# EAGLE design vw_j533 (EAGLE 9.6.2)
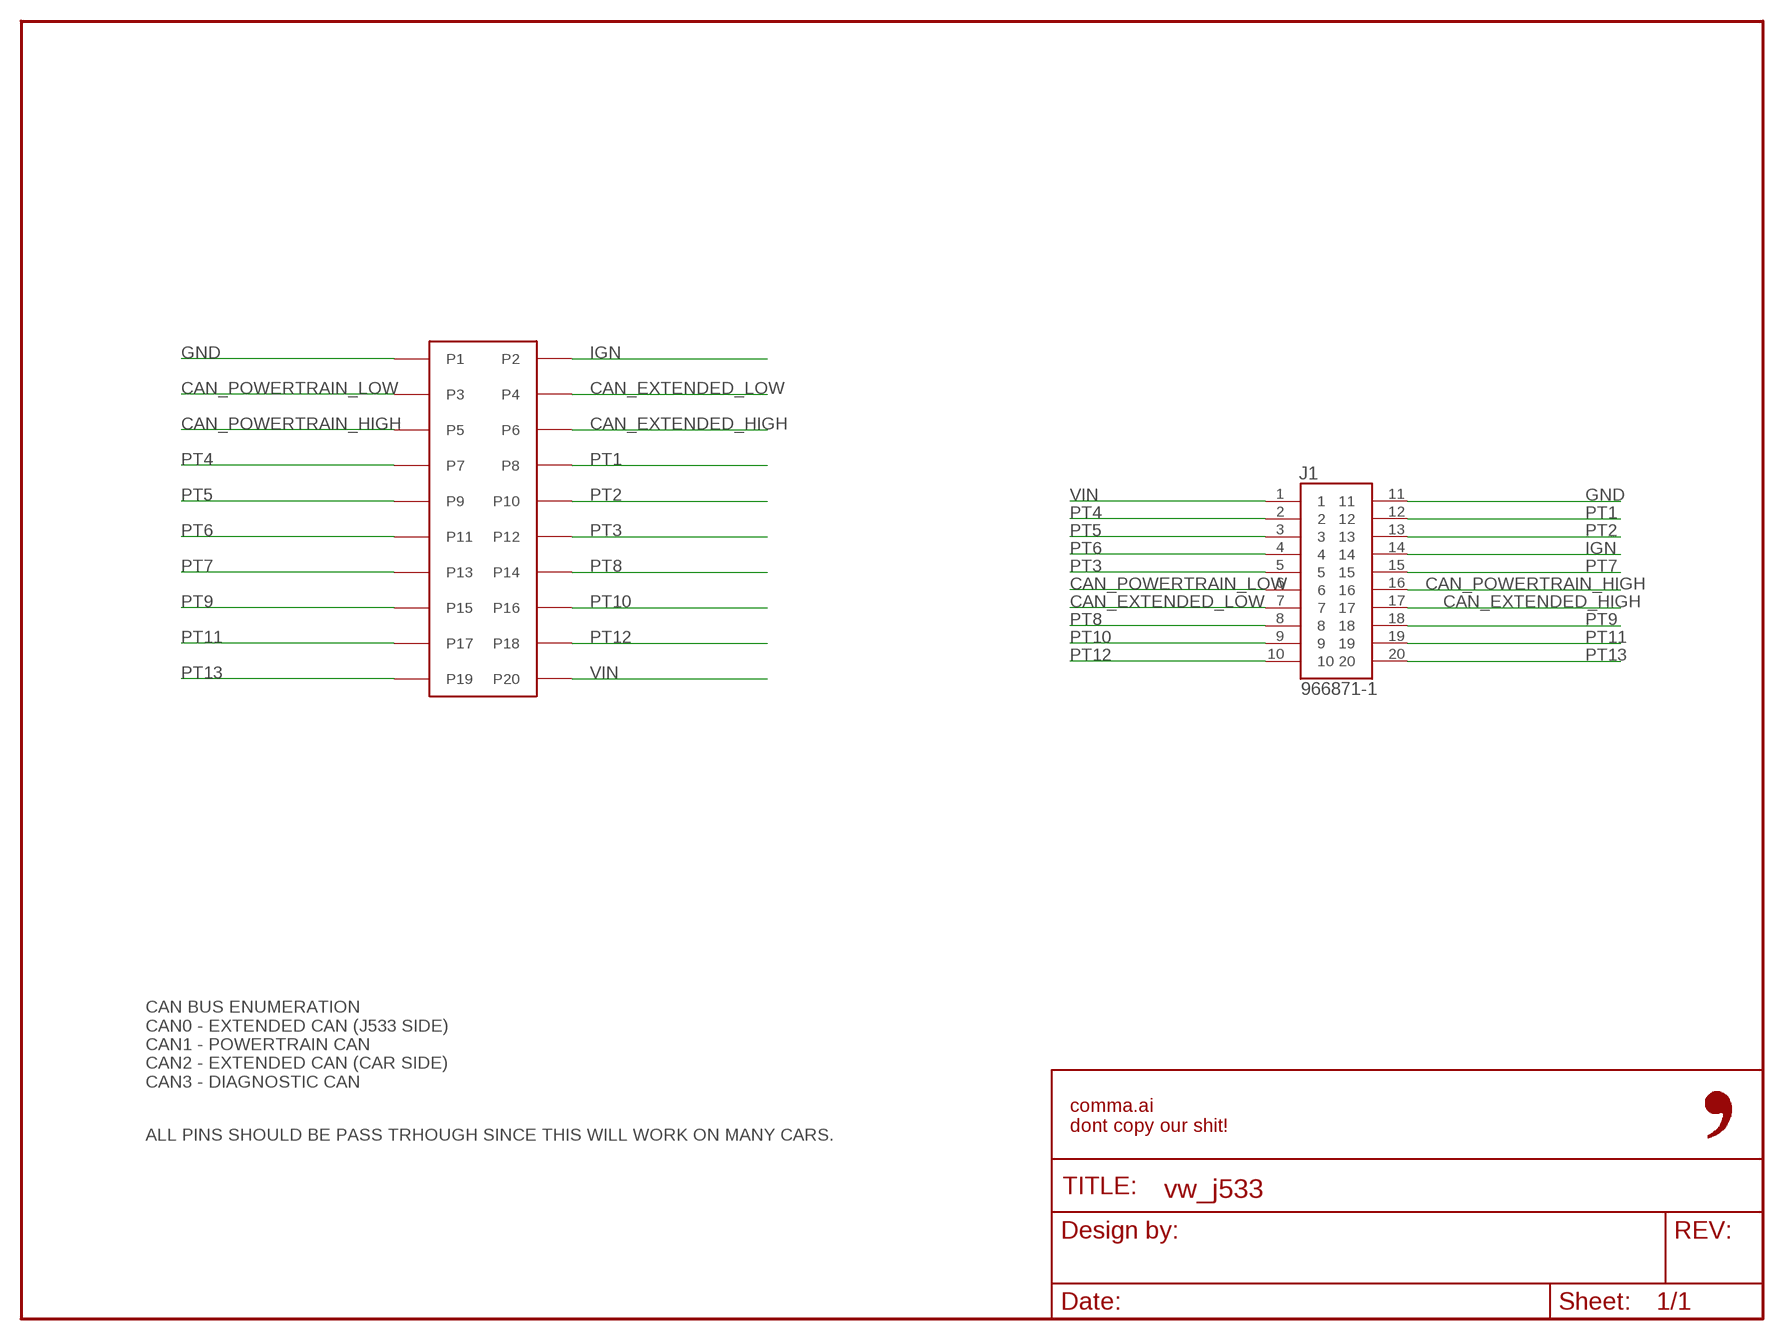
[diagram p0: schematic, sheet 1]

## Parts
FRAME1  FRAME-LETTERNO_PACKAGE  [DUMMY]
J1  966871-1  [TE_966871-1]
J2  5018762040  [5018762040]

## Nets
CAN_EXTENDED_HIGH: J1.17 J2.P6
CAN_EXTENDED_LOW: J1.7 J2.P4
CAN_POWERTRAIN_HIGH: J1.16 J2.P5
CAN_POWERTRAIN_LOW: J1.6 J2.P3
GND: J1.11 J2.P1
IGN: J1.14 J2.P2
PT1: J1.12 J2.P8
PT2: J1.13 J2.P10
PT3: J1.5 J2.P12
PT4: J1.2 J2.P7
PT5: J1.3 J2.P9
PT6: J1.4 J2.P11
PT7: J1.15 J2.P13
PT8: J1.8 J2.P14
PT9: J1.18 J2.P15
PT10: J1.9 J2.P16
PT11: J1.19 J2.P17
PT12: J1.10 J2.P18
PT13: J1.20 J2.P19
VIN: J1.1 J2.P20

## Notes on the sheet
- CAN BUS ENUMERATION
  CAN0 - EXTENDED CAN (J533 SIDE)
  CAN1 - POWERTRAIN CAN
  CAN2 - EXTENDED CAN (CAR SIDE)
  CAN3 - DIAGNOSTIC CAN
- ALL PINS SHOULD BE PASS TRHOUGH SINCE THIS WILL WORK ON MANY CARS.

## Library data of the parts
FRAME1 = comma.ai:FRAME-LETTER: Schematic Frame - Letter Standard 8.5x11 US Letter frame; DESIGNER: Nobody; VERSION: v01
J1 = comma.ai:966871-1: Conn Shrouded Header HDR 20 POS 2.5mm Solder RA Thru-Hole Automotive; COMMENT: 966871-1; CPN: CAI-HARNESS-TE-966871-1; DESCRIPTION: Conn Shrouded Header HDR 20 POS 2.5mm Solder RA Thru-Hole Automotive Tray; DIGI-KEY_PART_NUMBER: A119719-ND; EU_ROHS_COMPLIANCE: Compliant; MF: TE Connectivity; MP: 966871-1; PACKAGE: None; PURCHASE-URL: https://pricing.snapeda.com/search/part/966871-1/?ref=eda
J2 = comma.ai:5018762040; CPN: CAI-HARNESS-MOLEX-5018762040

## Board
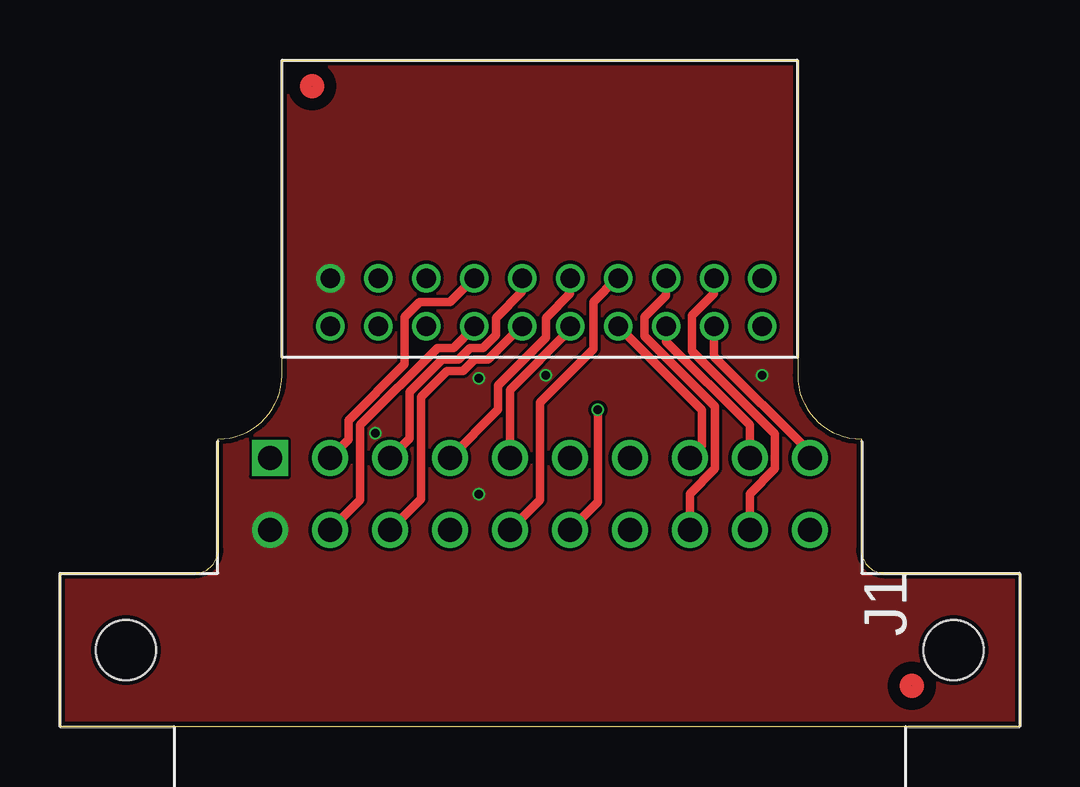
[diagram p1: board, top side]
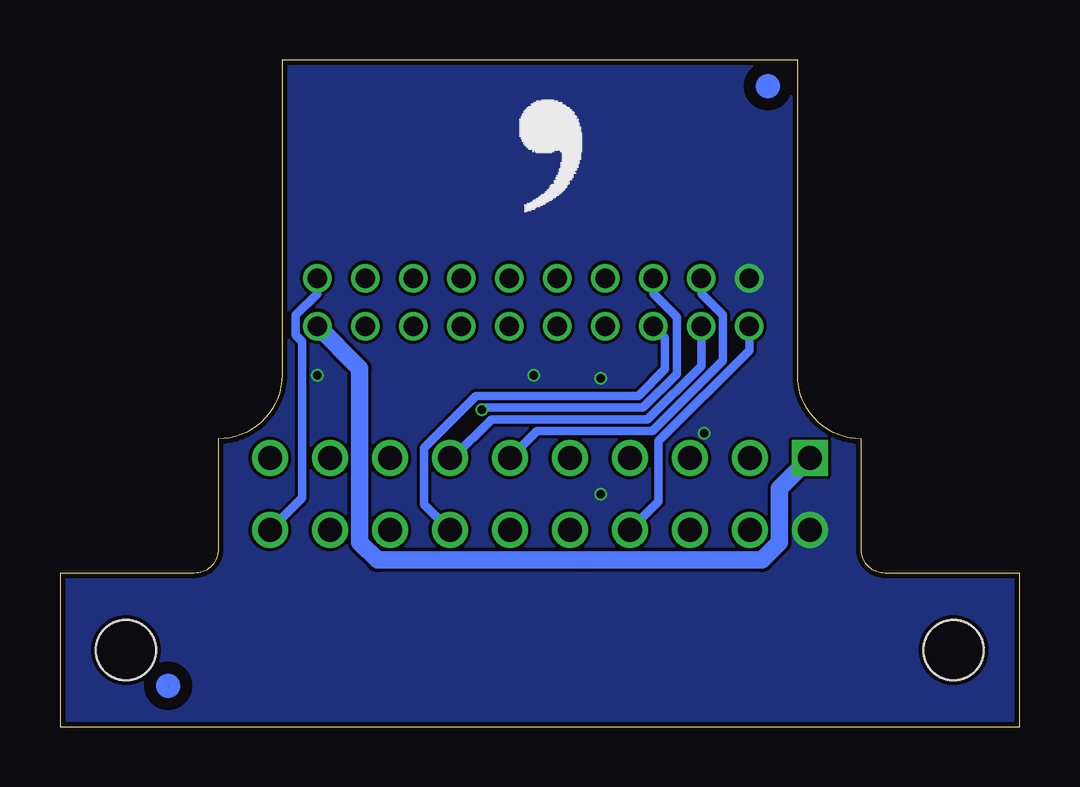
[diagram p2: board, bottom side, seen from below]

Size 40 x 27.8 mm. Coordinates in mm from the lower left corner, seen from the top.
Outline: 9.25,27.8 30.75,27.8 30.75,14.65 arc90 33.4,12 33.4,7.4 arc90 34.4,6.4 40,6.4 40,0 0,0 0,6.4 5.6,6.4 arc90 6.6,7.4 6.6,12 arc90 9.25,14.65 9.25,27.8
Copper layers (1*16): Top 0.035mm / dielectric 1.5mm / Bottom 0.035mm
Design rules "jlcpcb_2layer": minimum track width 5mil, minimum drill 12mil, track to track 5mil, track to pad 5mil, pad to pad 5mil, via to via 5mil, smd to smd 5mil, copper to edge 8mil, drill to drill 8mil, minimum pad ring 3mil, minimum via ring 3mil, stop-mask expansion 4mm, vias tented up to drill 20mil, thermal gap 10mil

### Footprints (pad centres in the part's own frame; a part is rotated, then mirrored left to right if it is on the bottom)
TE_966871-1 = drill 1 square: 1 -11.25,1.5 | drill 1: 2 -8.75,1.5; 3 -6.25,1.5; 4 -3.75,1.5; 5 -1.25,1.5; 6 1.25,1.5; 7 3.75,1.5; 8 6.25,1.5; 9 8.75,1.5; 10 11.25,1.5; 11 -11.25,-1.5; 12 -8.75,-1.5; 13 -6.25,-1.5; 14 -3.75,-1.5; 15 -1.25,-1.5; 16 1.25,-1.5; 17 3.75,-1.5; 18 6.25,-1.5; 19 8.75,-1.5; 20 11.25,-1.5 | hole 2.5: -17.25,-6.5; 17.25,-6.5
5018762040 = drill 0.8: P1 8.73,-1; P2 8.73,1; P3 6.73,-1; P4 6.73,1; P5 4.73,-1; P6 4.73,1; P7 2.73,-1; P8 2.73,1; P9 0.73,-1; P10 0.73,1; P11 -1.27,-1; P12 -1.27,1; P13 -3.27,-1; P14 -3.27,1; P15 -5.27,-1; P16 -5.27,1; P17 -7.27,-1; P18 -7.27,1; P19 -9.27,-1; P20 -9.27,1

### Placement (x,y rotation side)
FRAME1  20,17.7 0 top
J1  20,9.7 0 top
J2  20,17.7 180 top
U$1  [LOGO]  21.51,21.16 0 bottom
U$2  [FIDUCIAL]  35.5,1.7 0 top
U$3  [FIDUCIAL]  10.5,26.7 0 top

### Tracks (layer width: path | path; a pad name or v marks a point on that pad's centre or on a via)
CAN_EXTENDED_HIGH
  Bottom 0.356: J1.17 24.83,9.28 24.83,11.62 22.66,13.79 15.89,13.79 14.78,14.9 14.78,16.21 J2.P6
CAN_EXTENDED_LOW
  Bottom 0.356: J1.7 23.63,11.2 22.01,12.82 15.5,12.82 13.27,15.05 J2.P4
CAN_POWERTRAIN_HIGH  (via drill 0.35)
  Top 0.356: J1.16 22.42,9.37 v22.42,13.21
  Bottom 0.356: v22.42,13.21 22.42,13.31 15.7,13.31 14.29,14.72 14.29,17.08 15.27,18.06 J2.P5
CAN_POWERTRAIN_LOW
  Bottom 0.356: J1.6 20.11,12.34 15.3,12.34 12.37,15.27 12.37,17.16 13.27,18.06 J2.P3
GND  (via drill 0.35)
  other vias: 17.46,9.7 13.14,12.24 17.46,14.52 20.25,14.65 29.27,14.65
  pour Top (no thermals): -2,29.7 42,29.7 42,-2.3 -2,-2.3
  pour Bottom (no thermals): -3,30.7 43,30.7 43,-3.3 -3,-3.3
IGN
  Bottom 0.356: J1.14 15.05,9.4 15.05,11.91 11.27,15.68 J2.P2
PT1
  Top 0.356: J1.12 12.51,9.46 12.51,12.57 15.73,15.79 16.41,15.79 17.27,16.66 J2.P8
PT2
  Top 0.356: J1.13 15.05,9.5 15.05,13.75 16.13,14.83 16.81,14.83 17.29,15.31 17.84,15.31 19.23,16.7 J2.P10
PT3
  Top 0.356: J1.5 18.75,14.04 21.27,16.56 J2.P12
PT4
  Top 0.356: J1.2 12.02,11.97 12.02,12.77 14.37,15.11 14.37,17.07 14.99,17.7 16.27,17.7 J2.P7
PT5
  Top 0.356: J1.3 14.56,12.01 14.56,13.95 15.93,15.31 16.61,15.31 17.09,15.79 17.64,15.79 18.18,16.32 18.18,17.04 19.27,18.14 J2.P9
PT6
  Top 0.356: J1.4 18.27,13.22 18.27,14.24 20.25,16.22 20.25,17.05 21.27,18.06 J2.P11
PT7
  Top 0.356: J1.15 20,9.45 20,13.51 22.24,15.75 22.24,17.71 23.23,18.7 J2.P13
PT8
  Top 0.356: J2.P14 26.76,13.21 26.76,11.71 J1.8
PT9
  Top 0.356: J1.18 26.25,9.71 27.3,10.76 27.3,13.35 24.37,16.29 24.37,17.07 25.27,17.98 J2.P15
PT10
  Top 0.356: J1.9 28.75,12.58 25.27,16.06 J2.P16
PT11
  Top 0.356: J1.19 28.75,9.71 29.8,10.76 29.8,12.21 26.35,15.67 26.35,17.14 27.27,18.06 J2.P17
PT12
  Top 0.356: J1.10 31.25,11.45 27.27,15.43 J2.P18
PT13
  Bottom 0.356: J1.20 29.91,9.54 29.91,16.06 30.18,16.32 30.18,17.16 29.27,18.06 J2.P19
VIN
  Bottom 0.737: J1.1 10.01,9.95 10.01,7.68 10.73,6.96 26.77,6.96 27.5,7.69 27.5,14.93 J2.P20

### Text on the board
bDocu: WV J533 Harness Board / 07/23/24